# EAGLE schematic UPCB (EAGLE 6.3)
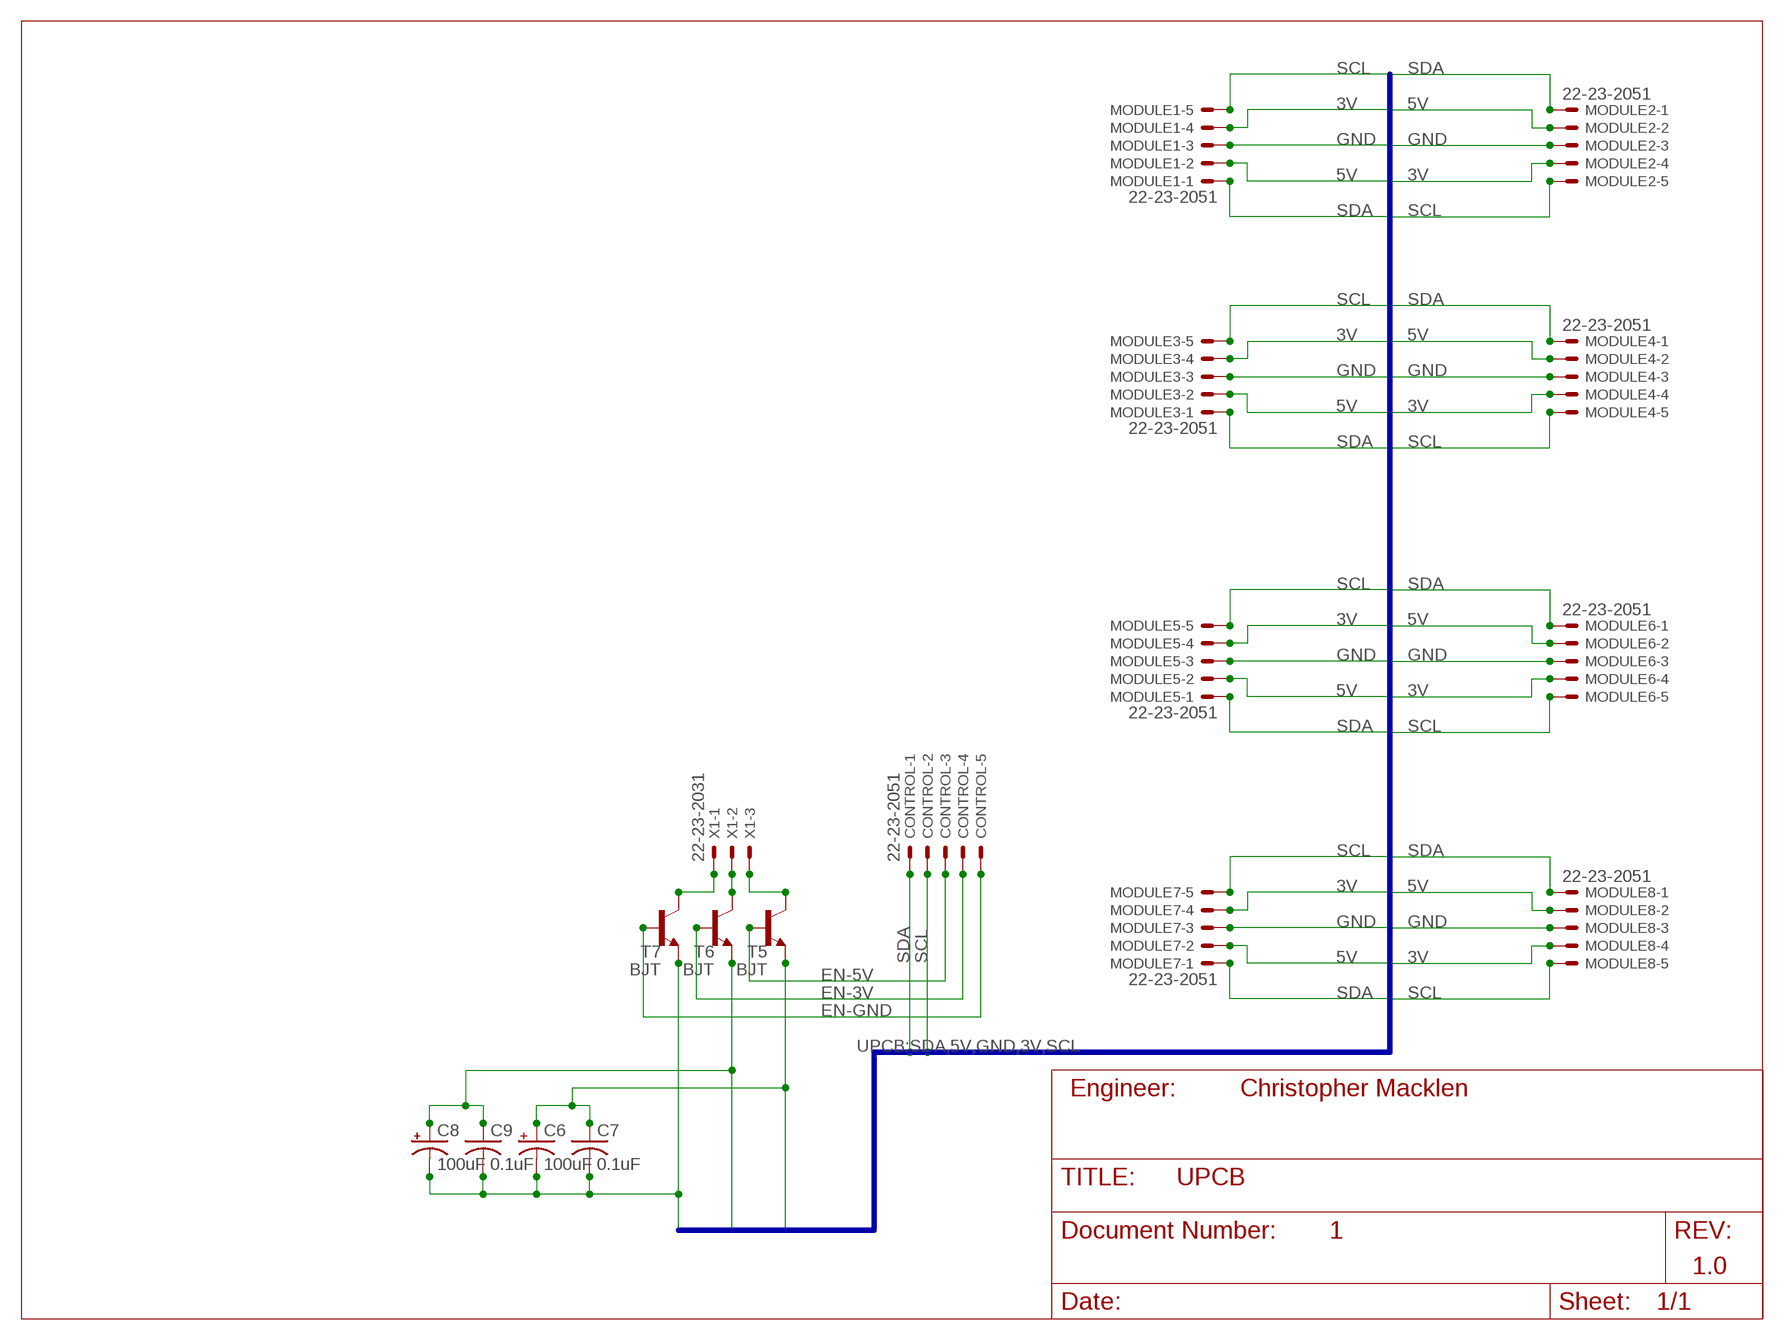
[diagram p0: schematic, sheet 1]

## Parts
C6  100uF  CPOL-USE2-5  [E2-5]
C7  0.1uF  C-US025-024X044  [C025-024X044]
C8  100uF  CPOL-USE2-5  [E2-5]
C9  0.1uF  C-US025-024X044  [C025-024X044]
CONTROL  22-23-2051  [22-23-2051]
MODULE1  22-23-2051  [22-23-2051]
MODULE2  22-23-2051  [22-23-2051]
MODULE3  22-23-2051  [22-23-2051]
MODULE4  22-23-2051  [22-23-2051]
MODULE5  22-23-2051  [22-23-2051]
MODULE6  22-23-2051  [22-23-2051]
MODULE7  22-23-2051  [22-23-2051]
MODULE8  22-23-2051  [22-23-2051]
T5  BJT  -NPN-TO92-E1  [TO92-E1]
T6  BJT  -NPN-TO92-E1  [TO92-E1]
T7  BJT  -NPN-TO92-E1  [TO92-E1]
X1  22-23-2031  [22-23-2031]

## Nets
3V: C8.+ C9.1 MODULE1.4 MODULE2.4 MODULE3.4 MODULE4.4 MODULE5.4 MODULE6.4 MODULE7.4 MODULE8.4 T6.3(E)
5V: C6.+ C7.1 MODULE1.2 MODULE2.2 MODULE3.2 MODULE4.2 MODULE5.2 MODULE6.2 MODULE7.2 MODULE8.2 T5.3(E)
EN-3V: CONTROL.4 T6.2(B)
EN-5V: CONTROL.3 T5.2(B)
EN-GND: CONTROL.5 T7.2(B)
GND: C6.- C7.2 C8.- C9.2 MODULE1.3 MODULE2.3 MODULE3.3 MODULE4.3 MODULE5.3 MODULE6.3 MODULE7.3 MODULE8.3 T7.3(E)
SCL: CONTROL.2 MODULE1.5 MODULE2.5 MODULE3.5 MODULE4.5 MODULE5.5 MODULE6.5 MODULE7.5 MODULE8.5
SDA: CONTROL.1 MODULE1.1 MODULE2.1 MODULE3.1 MODULE4.1 MODULE5.1 MODULE6.1 MODULE7.1 MODULE8.1
UF-3V: T6.1(C) X1.2
UF-5V: T5.1(C) X1.3
UF-GND: T7.1(C) X1.1

## Buses
UPCB:SDA,5V,GND,3V,SCL

## Notes on the sheet
- Engineer: | Christopher Macklen
- 1
- 1.0

## Library data of the parts
C6 C8 = rcl:CPOL-US: POLARIZED CAPACITOR, American symbol
C7 C9 = rcl:C-US: CAPACITOR, American symbol
CONTROL MODULE1-MODULE8 = con-molex:22-23-2051: .100" (2.54mm) Center Header - 5 Pin; MF: MOLEX; MPN: 22-23-2051; OC_FARNELL: 1462952; OC_NEWARK: 38C9178
T5-T7 = transistor:*-NPN-: NPN Transistror BF959 corrected 2008.03.06
X1 = con-molex:22-23-2031: .100" (2.54mm) Center Header - 3 Pin; MF: MOLEX; MPN: 22-23-2031; OC_FARNELL: 1462950; OC_NEWARK: 30C0862